# EAGLE schematic lt3750_test (EAGLE 9.6.2)
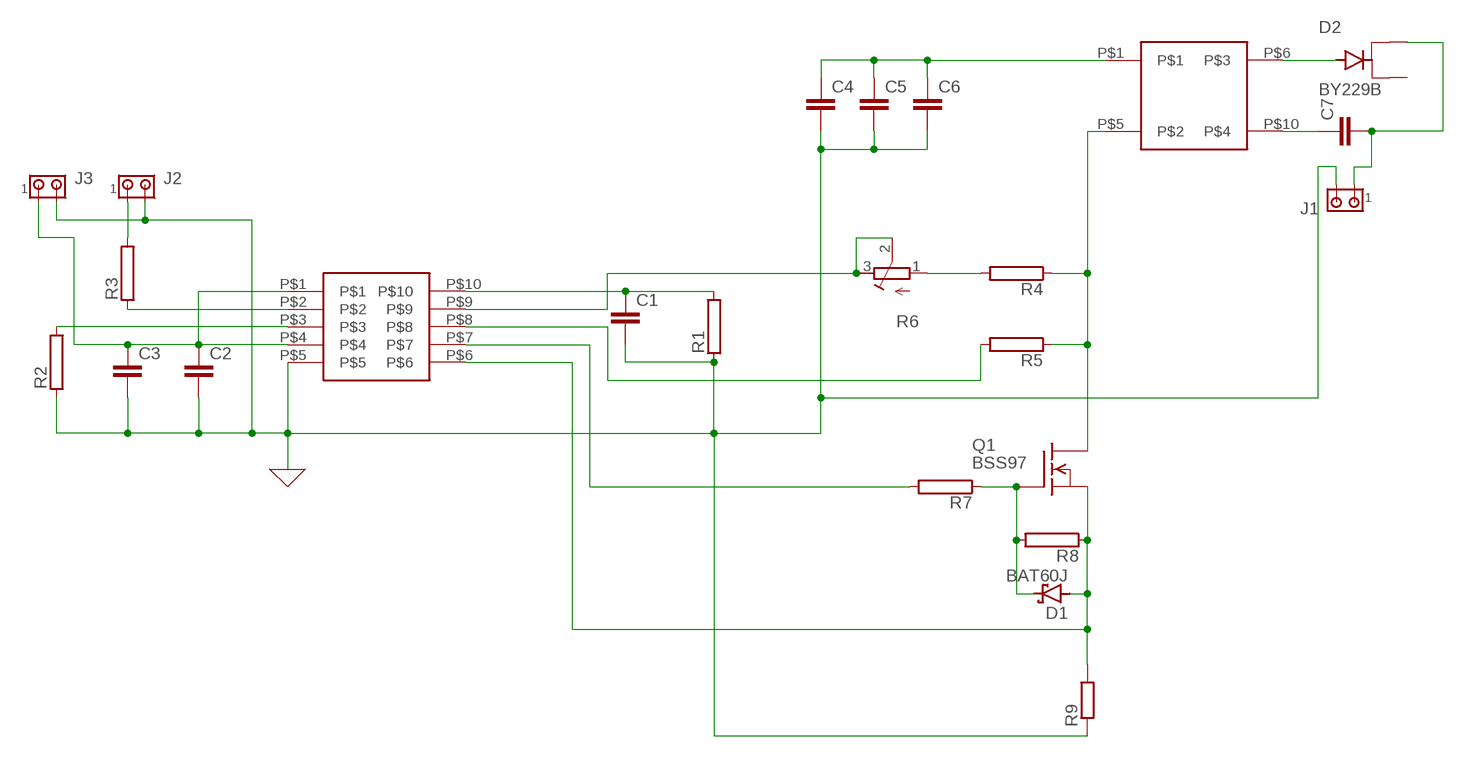
[diagram p0: schematic, sheet 1]

## Parts
C1  C5/3  [C5B3]
C2  C5/3  [C5B3]
C3  C5/3  [C5B3]
C4  C5/3  [C5B3]
C5  C5/3  [C5B3]
C6  C5/3  [C5B3]
C7  C5/3  [C5B3]
D1  BAT60J  [SOD323_ST]
D2  BY229B  [TO263AB]
J1  MTA02-100  [10X02MTA]
J2  MTA02-100  [10X02MTA]
J3  MTA02-100  [10X02MTA]
Q1  BSS97  [TO202]
R1  RAC01  [AC01]
R2  RAC01  [AC01]
R3  RAC01  [AC01]
R4  RAC01  [AC01]
R5  RAC01  [AC01]
R6  R-TRIMM64X  [RTRIM64X]
R7  RAC01  [AC01]
R8  RAC01  [AC01]
R9  SMK  [SMK]
U$1  LT3750  [LT3750]
U$2  32052  [32052]

## Nets
0: C1.2 C2.2 C3.2 C4.2 C5.2 C6.2 J1.2 J2.2 J3.2 R1.1 R2.1 R9.2 U$1.P$5 ; supply symbol labelled GND
N$1: R3.1 U$1.P$2
N$2: R2.2 U$1.P$3
N$3: C2.1 C3.1 J3.1 U$1.P$1 U$1.P$4
N$4: D2.2 U$2.P$6
N$6: C1.1 R1.2 U$1.P$10
N$7: C4.1 C5.1 C6.1 U$2.P$1
N$8: Q1.2(D) R4.1 R5.1 U$2.P$5
N$9: R6.2(S) R6.3(E) U$1.P$9
N$10: R4.2 R6.1(A)
N$11: R5.2 U$1.P$8
N$12: D1.A Q1.1(S) R8.1 R9.1 U$1.P$6
N$13: D1.C Q1.3(G) R7.1 R8.2
N$14: R7.2 U$1.P$7
N$15: J2.1 R3.2
N$16: C7.2 D2.1 J1.1
N$19: C7.1 U$2.P$10
Unconnected: D2.K

## Library data of the parts
C1-C7 = capacitor-wima:C: CAPACITOR naming: grid - package width
D1 = diode:BAT60J: Schottky barrier diode Source: www.st.com, BAT60J.pdf
D2 = diode:BY229B: DIODE Fast Switching Rectifier, 8A (Vishay)
J1-J3 = con-amp:MTA02-100: AMP connector
Q1 = transistor-fet:BSS97: N-Channel Enhancement MOSFET 200V; 1.5A; 1,6Ohm
R1-R5 R7 R8 = resistor-power:R: Power Resitor; OC_FARNELL: unknown; OC_NEWARK: unknown
R6 = rcl:R-TRIMM: Trimm resistor; SPICEMODEL: X; SPICEPREFIXL: POT
R9 = resistor-shunt:SMK: SMD SHUNT RESISTOR; OC_FARNELL: unknown; OC_NEWARK: unknown
U$1 = boostTest1215:LT3750
U$2 = boostTest1215:32052

## Net classes
0 default: width 1.25 mm, drill 0.5 mm, clearance 0.3 mm